# Altium schematic sheet BT.schdoc
size 379 x 253 mm
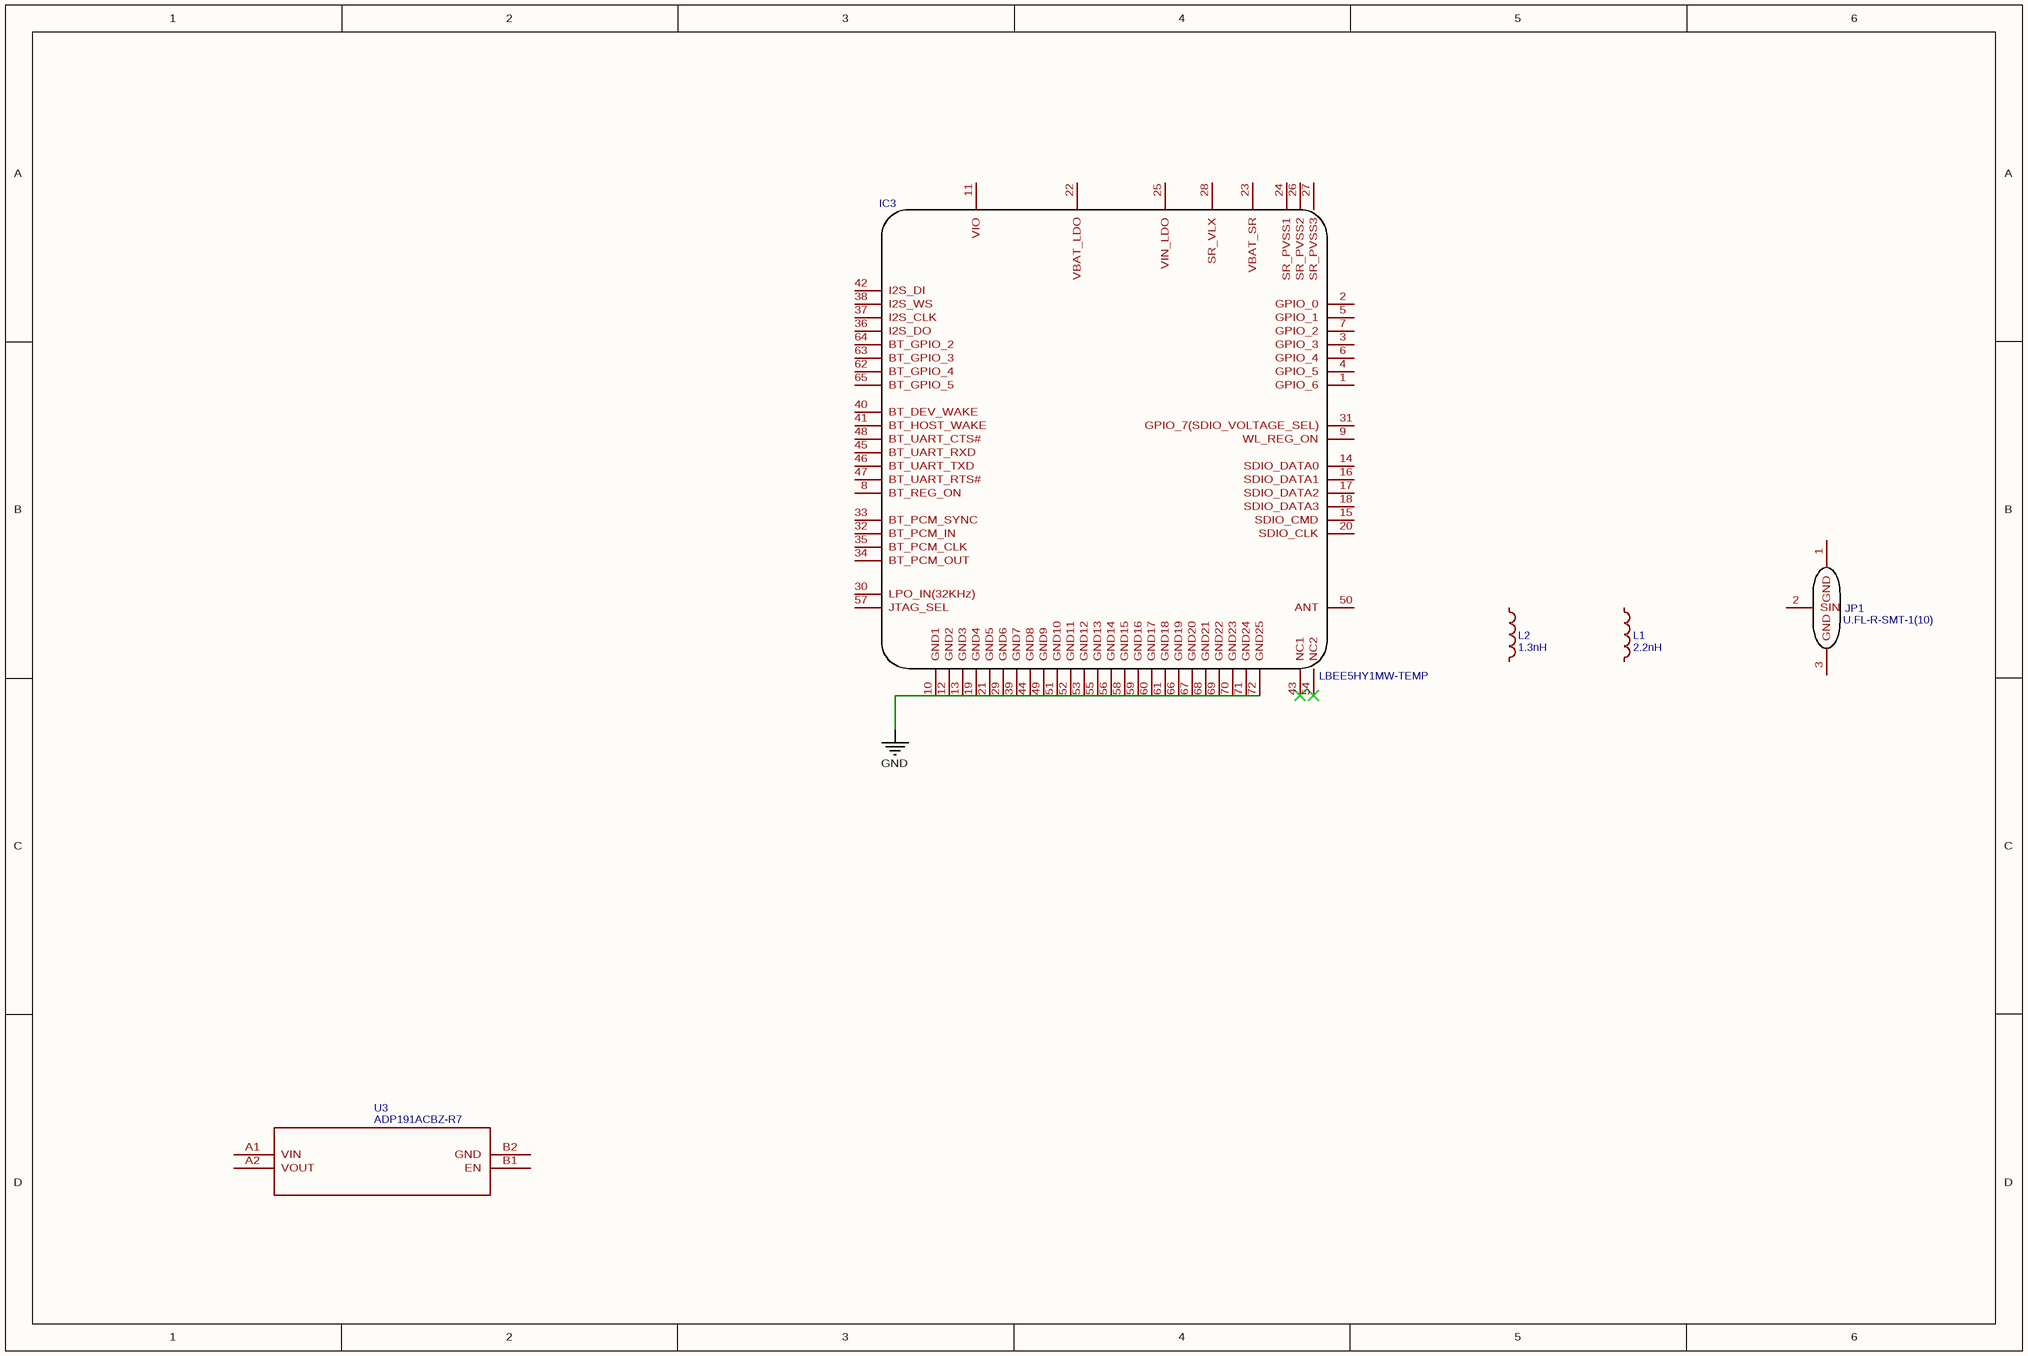
[diagram p0: BT.schdoc]

## Parts
IC3  LBEE5HY1MW-TEMP  [LBEE5HY1MWTEMP]
JP1  U.FL-R-SMT-1(10)  [ANT-SMD_UFL-R-SMT-1(10)]
L1  2.2nH  [L0805]
L2  1.3nH  [L0201]
U3  ADP191ACBZ-R7  [CB_4_3_ADI]

## Nets
GND: IC3.10(GND1) IC3.12(GND2) IC3.13(GND3) IC3.19(GND4) IC3.21(GND5) IC3.29(GND6) IC3.39(GND7) IC3.44(GND8) IC3.49(GND9) IC3.51(GND10) IC3.52(GND11) IC3.53(GND12) IC3.55(GND13) IC3.56(GND14) IC3.58(GND15) IC3.59(GND16) IC3.60(GND17) IC3.61(GND18) IC3.66(GND19) IC3.67(GND20) IC3.68(GND21) IC3.69(GND22) IC3.70(GND23) IC3.71(GND24) IC3.72(GND25)

Not connected (* = marked no-connect by the designer): IC3 1(GPIO_6) 2(GPIO_0) 3(GPIO_3) 4(GPIO_5) 5(GPIO_1) 6(GPIO_4) 7(GPIO_2) 8(BT_REG_ON) 9(WL_REG_ON) 11(VIO) 14(SDIO_DATA0) 15(SDIO_CMD) 16(SDIO_DATA1) 17(SDIO_DATA2) 18(SDIO_DATA3) 20(SDIO_CLK) 22(VBAT_LDO) 23(VBAT_SR) 24(SR_PVSS1) 25(VIN_LDO) 26(SR_PVSS2) 27(SR_PVSS3) 28(SR_VLX) 30(LPO_IN(32KHz)) 31(GPIO_7(SDIO_VOLTAGE_SEL)) 32(BT_PCM_IN) 33(BT_PCM_SYNC) 34(BT_PCM_OUT) 35(BT_PCM_CLK) 36(I2S_DO) 37(I2S_CLK) 38(I2S_WS) 40(BT_DEV_WAKE) 41(BT_HOST_WAKE) 42(I2S_DI) 43(NC1)* 45(BT_UART_RXD) 46(BT_UART_TXD) 47(BT_UART_RTS#) 48(BT_UART_CTS#) 50(ANT) 54(NC2)* 57(JTAG_SEL) 62(BT_GPIO_4) 63(BT_GPIO_3) 64(BT_GPIO_2) 65(BT_GPIO_5); JP1 1(GND) 2(SIN) 3(GND); L1 1 2; L2 1 2; U3 A1(VIN) A2(VOUT) B1(EN) B2(GND)

## Library data of the parts
IC3 = LBEE5HY1MW-TEMP: Contributor: Ke'Ondrae_Mell; spicePre: I; spiceSymbolName: LBEE5HY1MW-TEMP
JP1 = U.FL-R-SMT-1(10): BOM_Manufacturer: HRS; BOM_Supplier: LCSC; BOM_Manufacturer Part: U.FL-R-SMT-1(10); BOM_Supplier Part: C88373; spicePre: J; spiceSymbolName: U.FL-R-SMT-1(10)
L1 = 2.2nH: BOM_Manufacturer: FH; BOM_Manufacturer Part: VHF201209H2N2ST; nameAlias: Inductance; SMT Type: Extend; BOM_Supplier: LCSC; BOM_Supplier Part: C1037; BOM_JLCPCB SMD: Yes; spicePre: L; spiceSymbolName: VHF201209H2N2ST
L2 = 1.3nH: BOM_Manufacturer: TDK; BOM_Manufacturer Part: MLG0603P1N3BT000; nameAlias: Inductance; BOM_Supplier: LCSC; BOM_Supplier Part: C89432; spicePre: L; spiceSymbolName: MLG0603P1N3BT000
U3 = ADP191ACBZ-R7: Contributor: gmathey; spicePre: U; spiceSymbolName: ADP191ACBZ-R7